# EAGLE design mini-bridge (EAGLE 5.07)
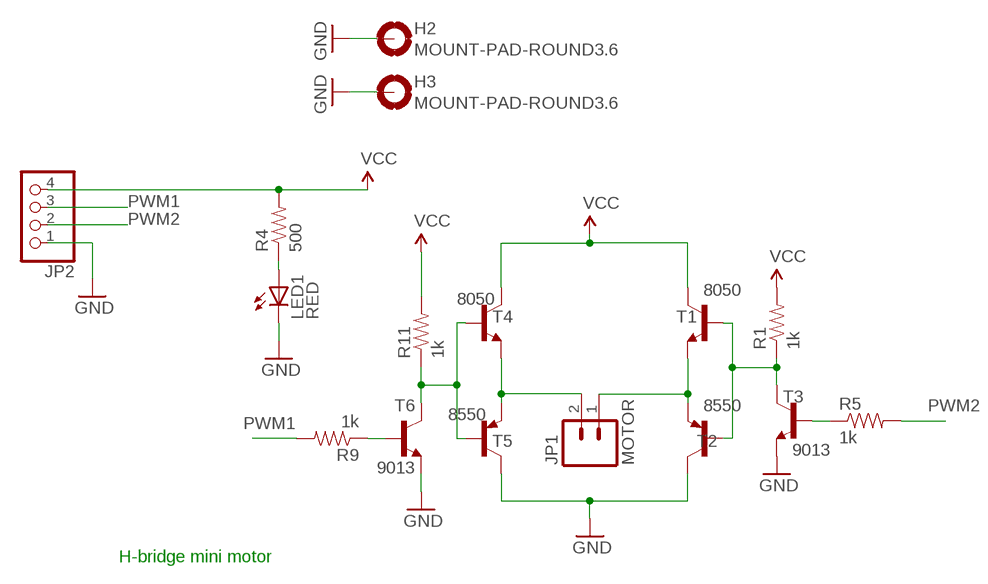
[diagram p0: schematic, sheet 1]

## Parts
H2  MOUNT-PAD-ROUND3.6  [3,6-PAD]
H3  MOUNT-PAD-ROUND3.6  [3,6-PAD]
JP1  MOTOR  CON-02-XH  [XH-1X2-LONG-LOCK]
JP2  PINHD-1X4/90_LOCK  [1X04/90_LOCK]
LED1  RED  LED0805  [CHIPLED_0805]
R1  1k  RESISTOR  [0805]
R4  500  RESISTOR0805  [0805]
R5  1k  RESISTOR0805  [0805]
R9  1k  RESISTOR0805  [0805]
R11  1k  RESISTOR0805  [0805]
T1  8050  BC808-NPN-SOT23-BEC  [SOT23-BEC]
T2  8550  BC857C-PNP-SOT23-BEC  [SOT23-BEC]
T3  9013  TRANSISTOR_NPNSOT23  [SOT23]
T4  8050  BC808-NPN-SOT23-BEC  [SOT23-BEC]
T5  8550  BC807-16-PNP-SOT23-BEC  [SOT23-BEC]
T6  9013  TRANSISTOR_NPNSOT23  [SOT23]

## Nets
GND: H2.B3,6(MOUNT) H3.B3,6(MOUNT) JP2.1 LED1.C T2.C T3.2(E) T5.C T6.2(E)
N$1: LED1.A R4.1
N$2: JP1.1 T1.E T2.E
N$3: R9.1 T6.1(B)
N$6: R11.1 T4.B T5.B T6.3(C)
N$7: R1.1 T1.B T2.B T3.3(C)
N$10: R5.1 T3.1(B)
N$17: JP1.2 T4.E T5.E
PWM1: JP2.3 R9.2
PWM2: JP2.2 R5.2
VCC: JP2.4 R1.2 R4.2 R11.2 T1.C T4.C

## Notes on the sheet
- H-bridge mini motor

## Library data of the parts
H2 H3 = holes:MOUNT-PAD-ROUND: MOUNTING PAD, round
JP1 = digital-toy:CON-02: Header 2 Standard 2-pin 0.1" header. Use with straight break away headers (SKU : PRT-00116), right angle break away headers (PRT-00553), swiss pins (PRT-00743), machine pins (PRT-00117), and female headers (PRT-00115). Molex polarized connector foot print use with SKU : PRT-08233 with associated crimp pins and housings.
JP2 = digital-toy:PINHD-1X4: PIN HEADER
LED1 = digital-toy:LED: LEDs Standard schematic elements and footprints for 5mm, 3mm, 1206, and 0603 sized LEDs. 5mm - Spark Fun Electronics SKU : COM-00529 (and others) copy led.lbr 0805 led here, by hyl digital-toy. 2010.6.29
R1 = SparkFun:RESISTOR: Resistor
R4 R5 R9 R11 = digital-toy:RESISTOR: Resistor
T1 T4 = digital-toy:*-NPN-: NPN Transistror most of sot-23 use the pacages sot23-BEC, top C, left B, right E. by hyl, digital-toy. and to-92 use ebc(from-top) by hyl, digital-toy.
T2 T5 = digital-toy:*-PNP-: PNP Transistror
T3 T6 = digital-toy:TRANSISTOR_NPN: Transistor NPN BJT configuration in SOT23 package. MMBT2222 is the common NPN we use. Double check BCE configuration again layout. copy from spark-fun, here is the typical sot-23,to-92 tansistor, sot23-BEC, to92-EBC,compare to *NPN* device, by hyl

## Board
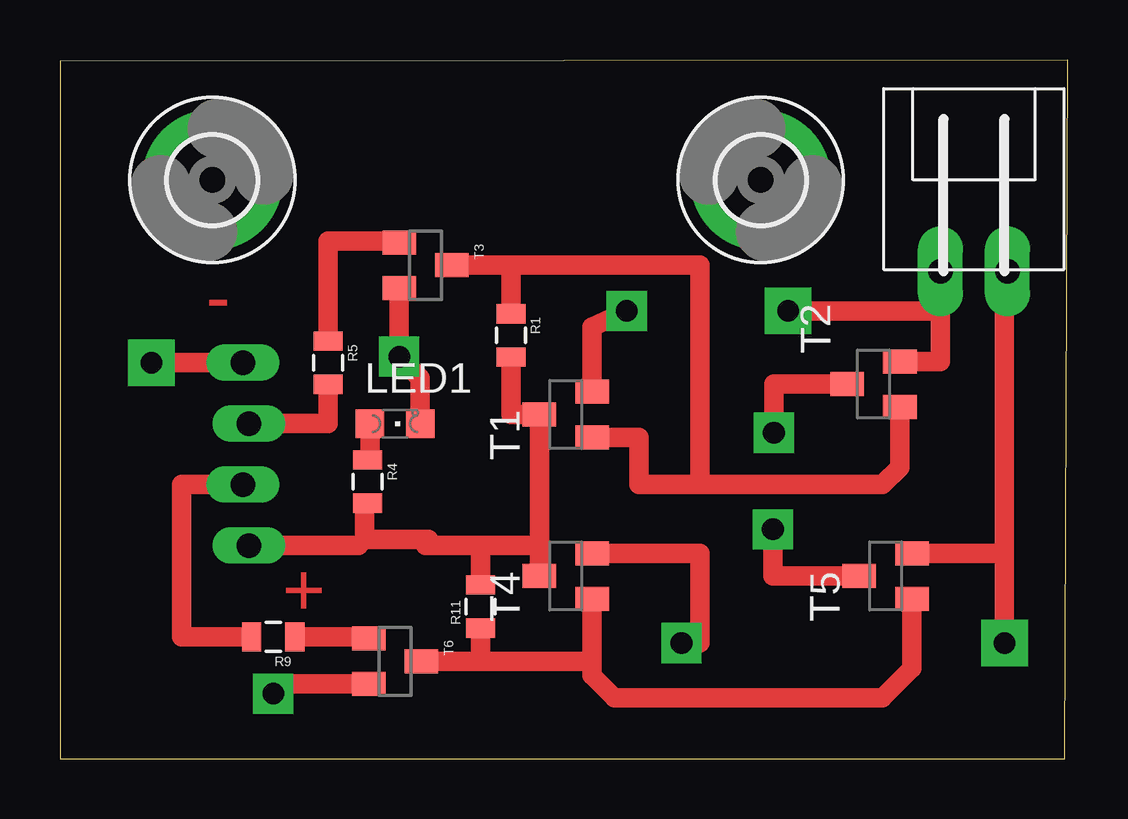
[diagram p1: board, top side]
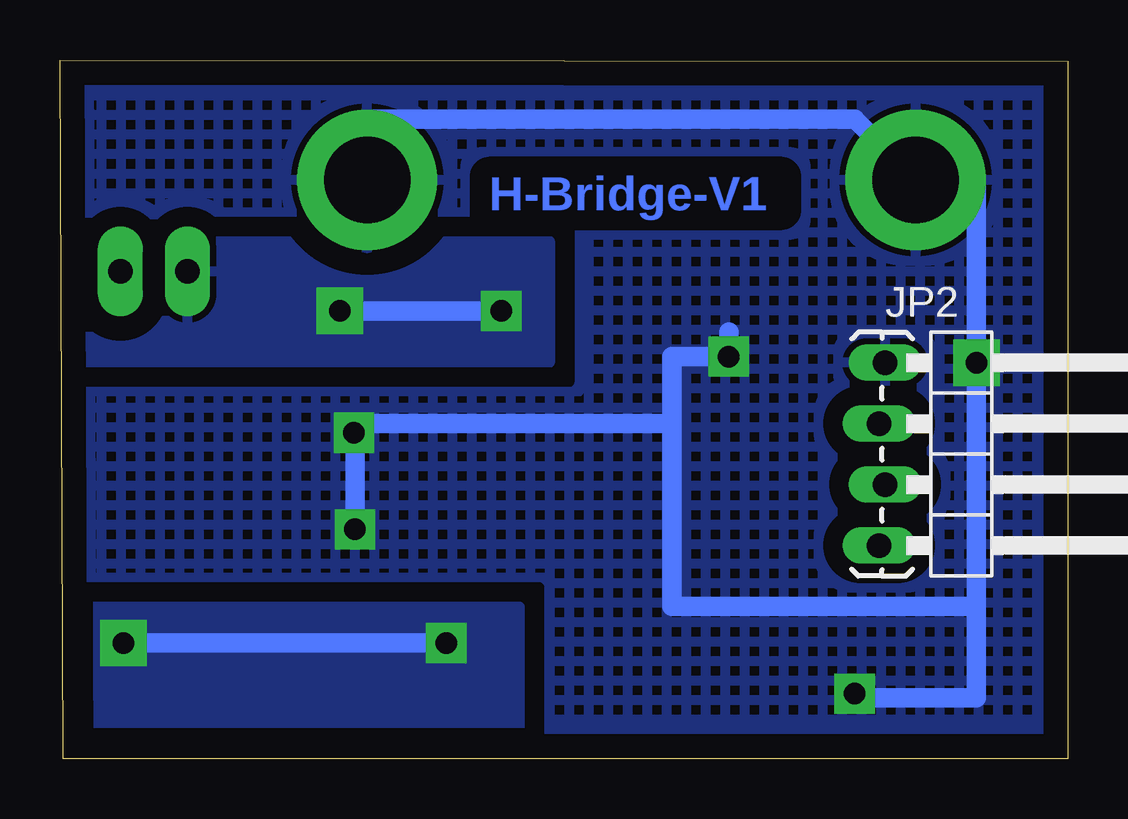
[diagram p2: board, bottom side, seen from below]

Size 42.02 x 29.13 mm. Coordinates in mm from the lower left corner, seen from the top.
Outline: 0,0 41.89,0 42.02,29.13 0,29.08 0,0
Copper layers (1*16): Top 0.035mm / dielectric 1.5mm / Bottom 0.035mm
Design rules "default": minimum track width 10mil, minimum drill 24mil, track to track 8mil, track to pad 8mil, pad to pad 8mil, via to via 8mil, smd to smd 8mil, copper to edge 40mil, drill to drill 8mil, minimum pad ring 10mil, minimum via ring 8mil, stop-mask expansion 4mil, vias tented up to drill 0mil, thermal gap 10mil

### Footprints (pad centres in the part's own frame; a part is rotated, then mirrored left to right if it is on the bottom)
3,6-PAD = drill 3.6 pad 5.842 round: B3,6 0,0
XH-1X2-LONG-LOCK = drill 1.016 pad 1.88 long: 1 -1.397,0; 2 1.397,0
1X04/90_LOCK = drill 1.016 long: 1 -3.81,-3.81; 2 -1.27,-4.064; 3 1.27,-3.81; 4 3.81,-4.064
CHIPLED_0805 = smd 1.2 x 1.2: A 0,-1.05; C 0,1.05
0805 = smd 0.8 x 1.2: 1 -0.9,0; 2 0.9,0
SOT23-BEC = smd 1 x 1.4: B -0.95,-1.1; C 0,1.1; E 0.95,-1.1
SOT23 = smd 1 x 1.4: 1 -0.95,-1.1; 2 0.95,-1.1; 3 0,1.1

### Placement (x,y rotation side)
H2  29.21,24.13 90 top
H3  6.35,24.13 0 top
JP1  38.1,20.32 0 top
JP2  3.81,12.7 270 bottom
LED1  13.97,13.97 270 top
R1  18.8,17.65 270 top
R4  12.83,11.56 270 top
R5  11.18,16.51 270 top
R9  8.89,5.08 180 top
R11  17.53,6.35 90 top
T1  21.08,14.35 90 top
T2  33.91,15.62 90 top
T3  15.24,20.57 270 top
T4  21.08,7.62 90 top
T5  34.42,7.62 90 top
T6  13.97,4.06 270 top

### Tracks (layer width: path | path; a pad name or v marks a point on that pad's centre or on a via)
GND  (via drill 0.9 pad 1.68, 0.9 pad 1.93)
  Top 0.813: T3.2 v14.14,16.76 15.02,15.88 LED1.C | T5.C 29.72,7.62 v29.72,9.57 | T6.2 8.89,3.11 v8.89,2.71 | T2.C 29.76,15.62 v29.76,13.59 | v3.81,16.51 JP2.1
  Bottom 0.813: 29.21,13.97 v29.76,13.59 | H2.B3,6 29.21,26.67 8.89,26.67 H3.B3,6 3.81,24.13 v3.81,16.51 | 3.81,6.35 3.81,2.54 8.89,2.54 v8.89,2.71 | v14.14,16.76 14.14,17.78 | v3.81,16.51 3.81,16.76 | v14.14,16.76 14.14,16.51 | v14.14,16.76 16.51,16.76 16.51,13.97 | 16.51,13.97 16.51,6.35 3.81,6.35 | 16.51,13.97 29.21,13.97 | 29.21,13.97 29.72,13.97 v29.72,9.57 | 3.81,6.35 v3.81,16.51
  pour Bottom (isolate 0.813, rank 6, hatched): -3.81,31.75 46.99,31.75 46.99,-3.81 -3.81,-3.81
N$1
  Top 0.813: R4.1 12.92,12.46 LED1.A
N$2  (via drill 0.9 pad 1.68, 0.9 pad 1.93)
  Top 0.813: T1.E 22.18,18 v23.62,18.67 | v30.35,18.67 36.7,18.67 | 36.7,18.67 JP1.1 | T2.E 36.7,16.57 36.7,18.67
  Bottom 0.813: v23.62,18.67 v30.35,18.67
  pour Bottom (isolate 1.016, rank 2): 21.59,21.59 21.59,16.51 50.8,16.51 50.8,21.59
N$3
  Top 0.813: T6.1 12.77,5.08 R9.1
N$6
  Top 0.813: T5.B 35.52,3.77 34.29,2.54 23.11,2.54 22.18,3.47 22.18,3.81 | T6.3 17.53,4.06 | 22.18,3.81 T4.B | 17.53,4.06 R11.1 | 17.53,4.06 21.93,4.06 22.18,3.81
N$7
  Top 0.813: T2.B 35.01,12.15 34.29,11.43 26.67,11.43 | 26.67,11.43 24.13,11.43 24.13,13.4 T1.B | 18.8,20.57 T3.3 | R1.1 18.8,20.57 | 18.8,20.57 26.67,20.57 26.67,11.43
N$10
  Top 0.813: R5.1 11.18,21.59 14.07,21.59 T3.1
N$17  (via drill 0.9 pad 1.68, 0.9 pad 1.93)
  Top 0.813: T4.E 26.67,8.57 26.67,4.83 v25.91,4.83 | 39.37,8.57 T5.E | v39.37,4.83 39.37,8.57 | JP1.2 39.37,20.32 39.37,8.57
  Bottom 0.813: v25.91,4.83 v39.37,4.83
  pour Bottom (isolate 1.27, rank 2): 53.34,6.35 22.86,6.35 22.86,1.27 53.34,1.27
PWM1
  Top 0.813: R9.2 5.08,5.08 5.08,11.43 JP2.3
PWM2
  Top 0.813: R5.2 11.18,13.97 JP2.2
VCC
  Top 0.813: 17.53,8.89 R11.2 | 12.7,9.14 15.24,9.14 | 15.24,9.14 15.37,9.14 | 17.53,8.89 15.24,8.89 15.24,9.14 | R1.2 18.8,14.35 T1.C 19.98,8.89 | 17.53,8.89 19.98,8.89 | 19.98,8.89 T4.C | R4.2 12.7,10.66 12.7,9.14 | JP2.4 12.45,8.89 12.7,9.14

### Text on the board
Top: - | +
Bottom: H-Bridge-V1